# Altium schematic sheet MCU_4G_SEN.SchDoc
size A2; SheetNumber: 1; SheetTotal: 1
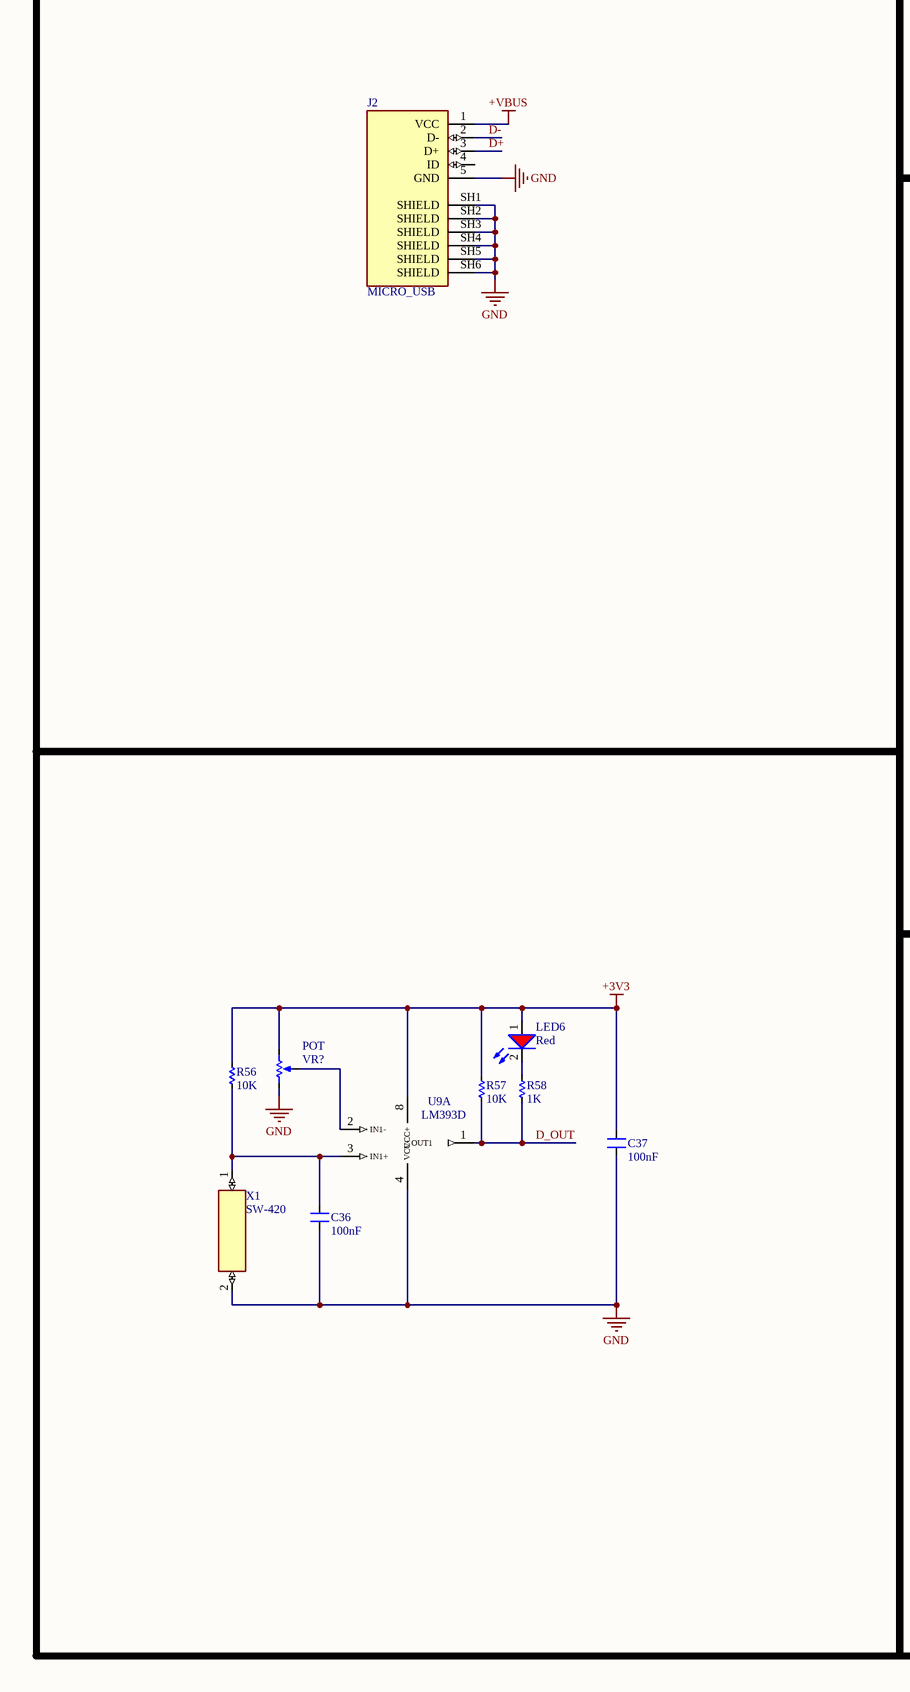
[diagram p0: MCU_4G_SEN.SchDoc, left]
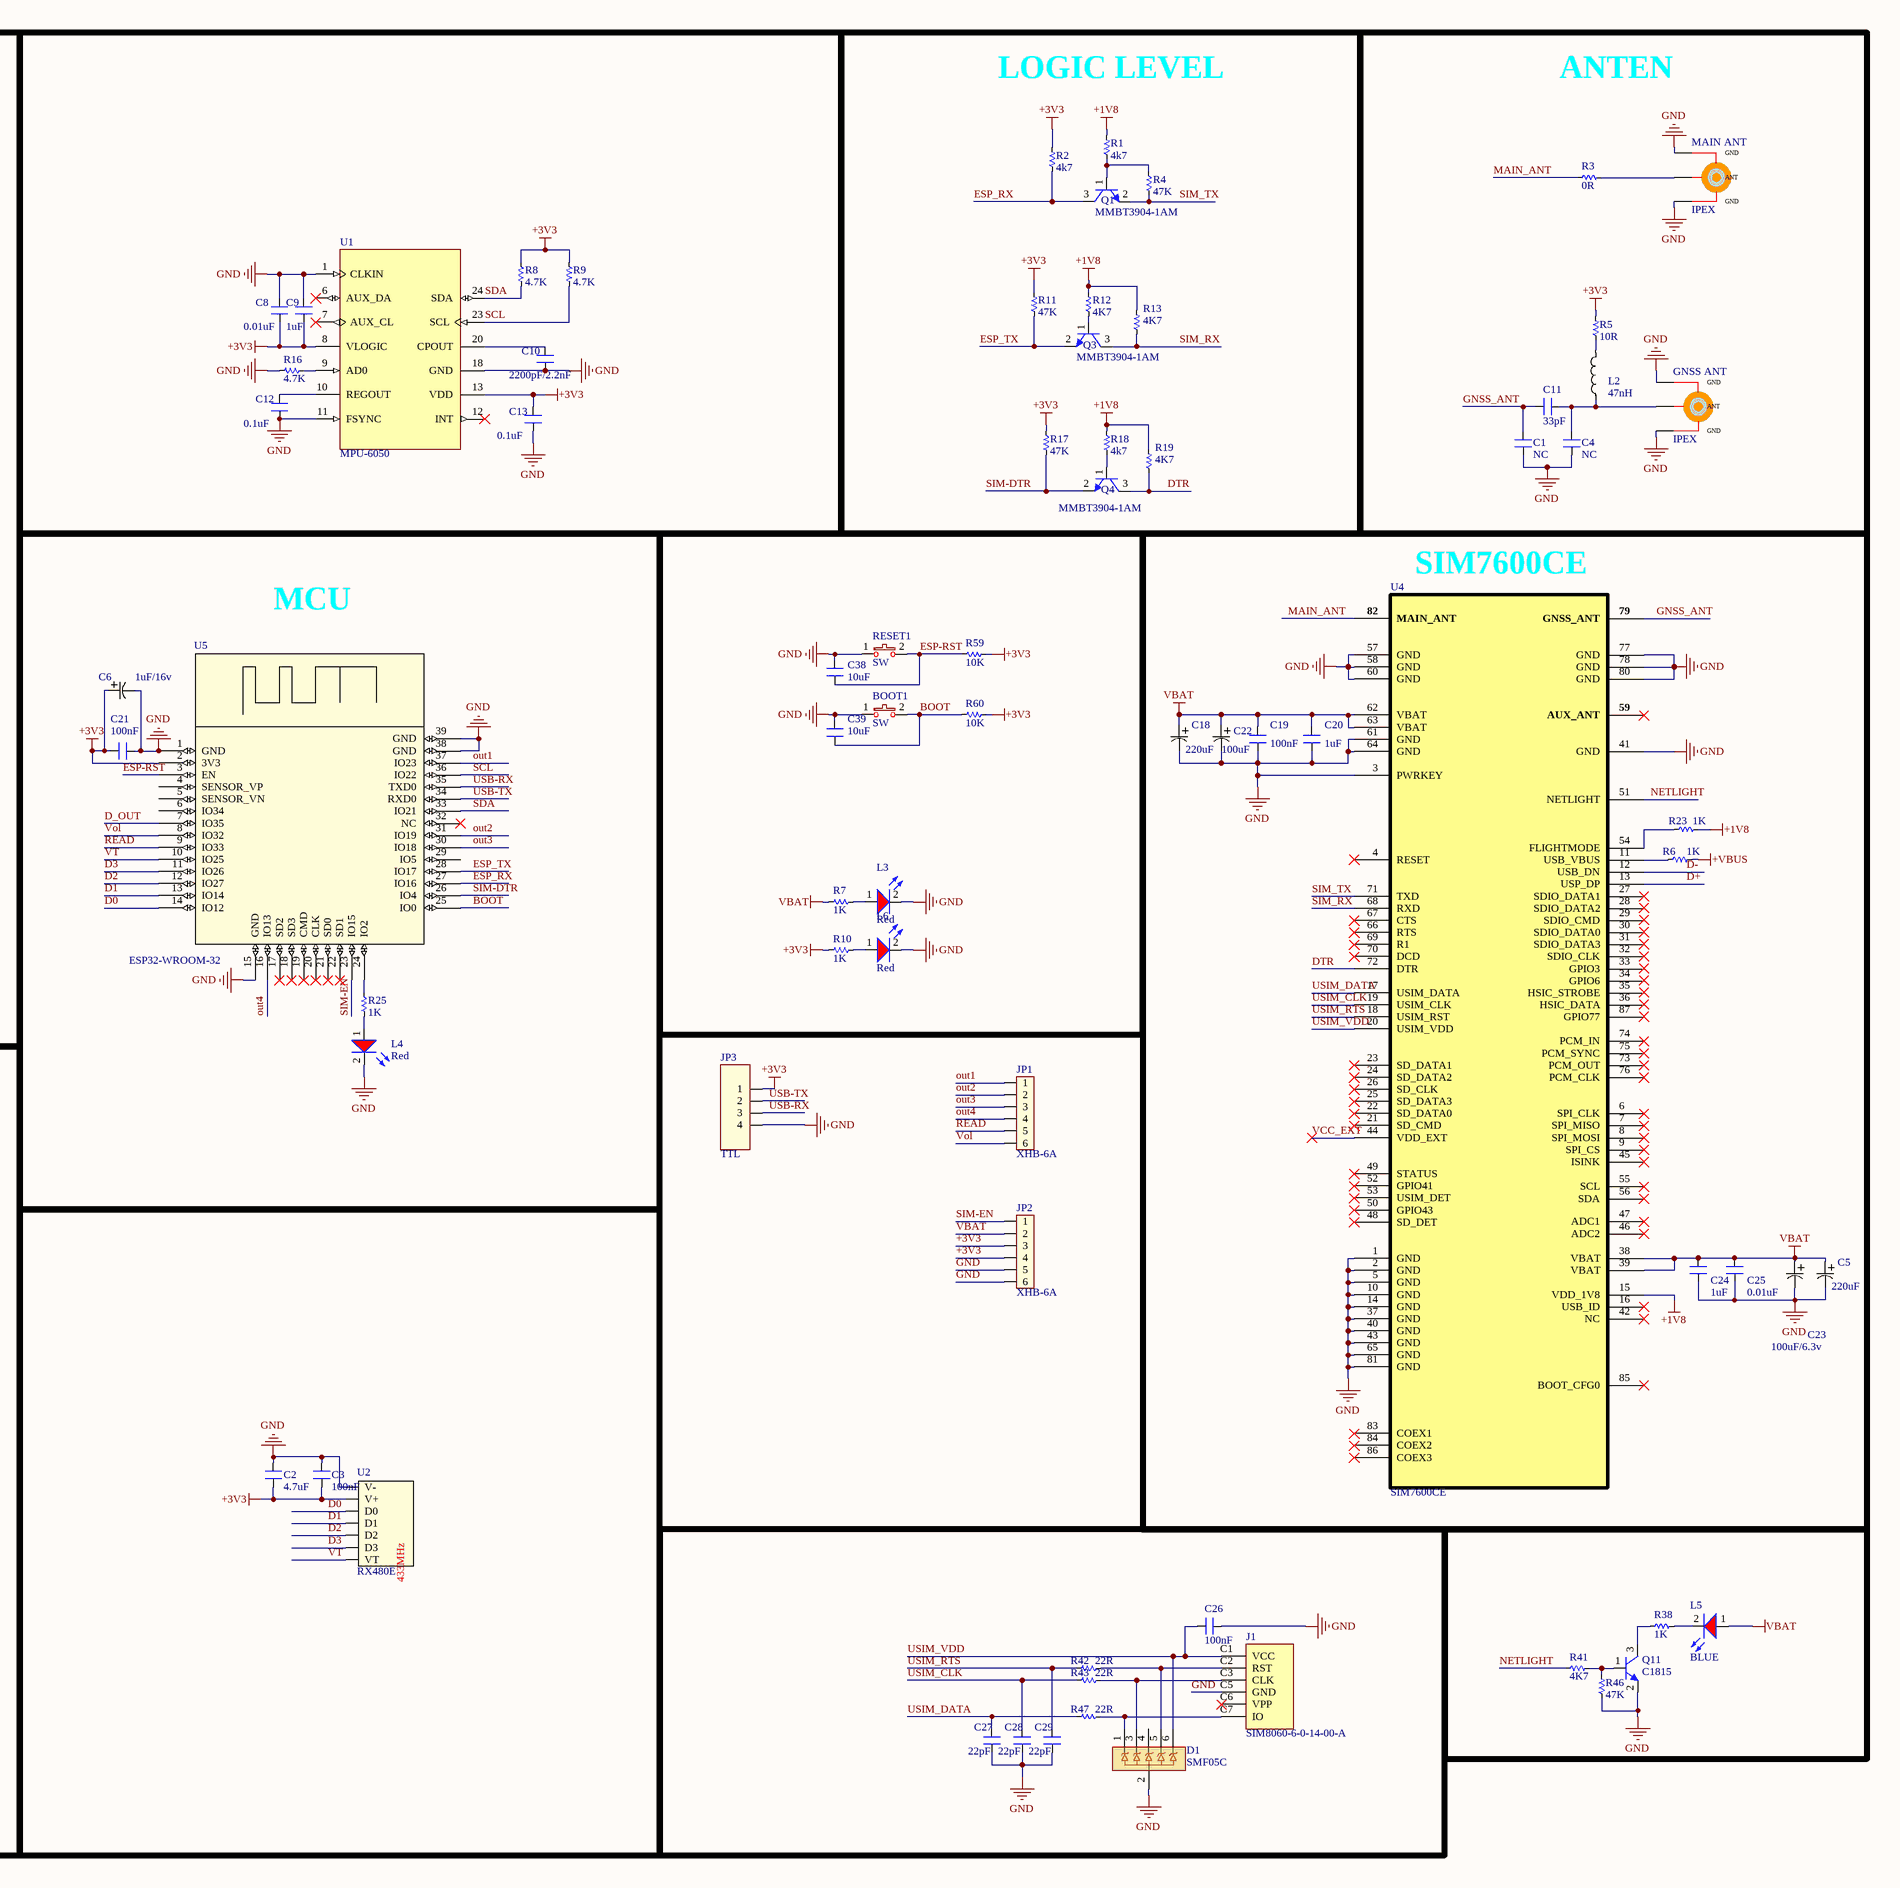
[diagram p1: MCU_4G_SEN.SchDoc, right]

## Parts
BOOT1  SW  [BUTTON_3X4MM_2PIN]
C1  NC  [CAP-0603]
C2  4.7uF  [CAP-0603]
C3  100nF  [CAP-0603]
C4  NC  [CAP-0603]
C5  220uF  [CAP-TANTALUM-2312 - ( 6032M )]
C6  1uF/16v  [CAP-TANTALUM-1206 - ( 3216 )]
C8  0.01uF  [CAP-0603]
C9  1uF  [CAP-0603]
C10  2200pF/2.2nF  [CAP-0603]
C11  33pF  [CAP-0603]
C12  0.1uF  [CAP-0603]
C13  0.1uF  [CAP-0603]
C18  220uF  [CAP-TANTALUM-2312 - ( 6032M )]
C19  100nF  [CAP-0603]
C20  1uF  [CAP-0603]
C21  100nF  [CAP-0603]
C22  100uF  [CAP-TANTALUM-1206 - ( 3216 )]
C23  100uF/6.3v  [CAP-TANTALUM-1206 - ( 3216 )]
C24  1uF  [CAP-0603]
C25  0.01uF  [CAP-0603]
C26  100nF  [CAP-0603]
C27  22pF  [CAP-0603]
C28  22pF  [CAP-0603]
C29  22pF  [CAP-0603]
C36  100nF  [CAP-0603]
C37  100nF  [CAP-0603]
C38  10uF  [CAP-0603]
C39  10uF  [CAP-0603]
D1  SMF05C  [SOT-363]
GNSS_ANT  IPEX  [IPEX-ANTEN]
J1  SIM8060-6-0-14-00-A  [NanoSim_BKK]
J2  MICRO_USB  [MICRO_USB _PAD]
JP1  XHB-6A  [XH2.54-6P_THRU]
JP2  XHB-6A  [XH2.54-6P_THRU]
JP3  TTL  [JP_4PIN]
L2  47nH  [IN-0603]
L3  value Red  [LED_0805_smd]  (hidden comment: LED)
L4  value Red  [LED_0805_smd]  (hidden comment: LED)
L5  value BLUE  [LED_0805_smd]  (hidden comment: LED)
L6  value Red  [LED_0805_smd]  (hidden comment: LED)
LED6  value Red  [LED_0805_smd]  (hidden comment: SMD)
MAIN_ANT  IPEX  [IPEX-ANTEN]
POT  VR?  [Pot_trim]
Q1  MMBT3904-1AM  [SOT-23]
Q3  MMBT3904-1AM  [SOT-23]
Q4  MMBT3904-1AM  [SOT-23]
Q11  C1815  [SOT-23]
R1  4k7  [RES-0603]
R2  4k7  [RES-0603]
R3  0R  [RES-0603]
R4  47K  [RES-0603]
R5  10R  [RES-0603]
R6  1K  [RES-0603]
R7  1K  [RES-0603]
R8  4.7K  [RES-0603]
R9  4.7K  [RES-0603]
R10  1K  [RES-0603]
R11  47K  [RES-0603]
R12  4K7  [RES-0603]
R13  4K7  [RES-0603]
R16  4.7K  [RES-0603]
R17  47K  [RES-0603]
R18  4k7  [RES-0603]
R19  4K7  [RES-0603]
R23  1K  [RES-0603]
R25  1K  [RES-0603]
R38  1K  [RES-0603]
R41  4K7  [RES-0603]
R42  22R  [RES-0603]
R43  22R  [RES-0603]
R46  47K  [RES-0603]
R47  22R  [RES-0603]
R56  10K  [RES-0603]
R57  10K  [RES-0603]
R58  1K  [RES-0603]
R59  10K  [RES-0603]
R60  10K  [RES-0603]
RESET1  SW  [BUTTON_3X4MM_2PIN]
U1  MPU-6050  [QFN-24]
U2  RX480E  [RX480E]
U4  SIM7600CE  [SIM7600C]
U5  ESP32-WROOM-32  [ESP32-WROOM-32D]
U9  LM393D  [SOIC-8]  (part A of 2)
X1  SW-420  [SW-420]

## Blocks framed on the sheet
LOGIC LEVEL: Q1 Q3 Q4 R1 R2 R4 R11-R13 R17-R19
ANTEN: C1 C4 C11 GNSS_ANT L2 MAIN_ANT R3 R5
MCU: C6 C21 L4 R25 U5
SIM7600CE: C5 C18-C20 C22-C25 R6 R23 U4

## Nets
+1V8: R1.1 R12.1 R13.1 R18.1 R19.1 R23.1 U4.15(VDD_1V8)
+3V3: C2.1 C3.1 C6.1 C8.1 C9.1 C13.2 C21.1 C37.2 JP2.3 JP2.4 JP3.1 LED6.1(A) POT.3(BOT) R2.1 R5.1 R8.2 R9.2 R10.1 R11.1 R17.1 R56.1 R57.1 R59.2 R60.2 U1.8(VLOGIC) U1.13(VDD) U2.2(V+) U5.2(3V3) U9.8(VCC+)
+VBUS: J2.1(VCC) R6.1
GND: BOOT1.1 C1.1 C2.2 C3.2 C4.1 C5.2 C6.2 C8.2 C9.2 C10.1 C12.1 C13.1 C18.2 C19.1 C20.1 C21.2 C22.2 C23.2 C24.1 C25.1 C26.2 C27.2 C28.2 C29.2 C36.1 C37.1 C38.1 C39.1 D1.2(C2) GNSS_ANT.1(GND) GNSS_ANT.3(GND) J1.C5(GND) J2.5(GND) J2.SH1(SHIELD) J2.SH2(SHIELD) J2.SH3(SHIELD) J2.SH4(SHIELD) J2.SH5(SHIELD) J2.SH6(SHIELD) JP2.5 JP2.6 JP3.4 L3.2(K) L4.2(K) L6.2(K) MAIN_ANT.1(GND) MAIN_ANT.3(GND) POT.1(TOP) Q11.2(E) R16.1 R46.2 RESET1.1 U1.1(CLKIN) U1.11(FSYNC) U1.18(GND) U2.1(V-) U4.1(GND) U4.2(GND) U4.3(PWRKEY) U4.5(GND) U4.10(GND) U4.14(GND) U4.37(GND) U4.40(GND) U4.41(GND) U4.43(GND) U4.57(GND) U4.58(GND) U4.60(GND) U4.61(GND) U4.64(GND) U4.65(GND) U4.77(GND) U4.78(GND) U4.80(GND) U4.81(GND) U5.1(GND) U5.15(GND) U5.38(GND) U5.39(GND) U9.4(VCC-) X1.2
VBAT: C5.1 C18.1 C19.2 C20.2 C22.1 C23.1 C24.2 C25.2 JP2.2 L5.1(A) R7.1 U4.38(VBAT) U4.39(VBAT) U4.62(VBAT) U4.63(VBAT)
BOOT: BOOT1.2 C39.2 R60.1 U5.25(IO0)
D0: U2.3(D0) U5.14(IO12)
D1: U2.4(D1) U5.13(IO14)
D2: U2.5(D2) U5.12(IO27)
D3: U2.6(D3) U5.11(IO26)
D+: J2.3(D+) U4.13(USP_DP)
D-: J2.2(D-) U4.12(USB_DN)
D_OUT: R57.2 R58.2 U5.7(IO35) U9.1(OUT1)
DTR: Q4.3(C) R19.2 U4.72(DTR)
ESP-RST: C38.2 R59.1 RESET1.2 U5.3(EN)
ESP_RX: Q1.3(C) R2.2 U5.27(IO16)
ESP_TX: Q3.2(E) R11.2 U5.28(IO17)
GNSS_ANT: C1.2 C11.1 U4.79(GNSS_ANT)
MAIN_ANT: R3.2 U4.82(MAIN_ANT)
NETLIGHT: R41.2 U4.51(NETLIGHT)
out1: JP1.1 U5.37(IO23)
out2: JP1.2 U5.31(IO19)
out3: JP1.3 U5.30(IO18)
out4: JP1.4 U5.16(IO13)
READ: JP1.5 U5.9(IO33)
SCL: R9.1 U1.23(SCL) U5.36(IO22)
SDA: R8.1 U1.24(SDA) U5.33(IO21)
SIM-DTR: Q4.2(E) R17.2 U5.26(IO4)
SIM-EN: JP2.1 U5.23(IO15)
SIM_RX: Q3.3(C) R13.2 U4.68(RXD)
SIM_TX: Q1.2(E) R4.2 U4.71(TXD)
USB-RX: JP3.3 U5.35(TXD0)
USB-TX: JP3.2 U5.34(RXD0)
USIM_CLK: C28.1 R43.1 U4.19(USIM_CLK)
USIM_DATA: C27.1 R47.1 U4.17(USIM_DATA)
USIM_RTS: C29.1 R42.1 U4.18(USIM_RST)
USIM_VDD: C26.1 D1.6(C6) J1.C1(VCC) U4.20(USIM_VDD)
VCC_EXT: U4.44(VDD_EXT)
Vol: JP1.6 U5.8(IO32)
VT: U2.7(VT) U5.10(IO25)
NetC4_2: C4.2 C11.2 GNSS_ANT.2(ANT) L2.1
NetC10_2: C10.2 U1.20(CPOUT)
NetC12_2: C12.2 U1.10(REGOUT)
NetC36_2: C36.2 R56.2 U9.3(IN1+) X1.1
NetD1_1: D1.1(C1) J1.C7(IO) R47.2
NetD1_3: D1.3(C3) J1.C3(CLK) R43.2
NetD1_5: D1.5(C5) J1.C2(RST) R42.2
NetL2_2: L2.2 R5.2
NetL3_1: L3.1(A) R7.2
NetL4_1: L4.1(A) R25.2
NetL5_2: L5.2(K) R38.1
NetL6_1: L6.1(A) R10.2
NetLED6_2: LED6.2(K) R58.1
NetMAIN_ANT_2: MAIN_ANT.2(ANT) R3.1
NetPOT_2: POT.2(TAP) U9.2(IN1-)
NetQ1_1: Q1.1(B) R1.2 R4.1
NetQ3_1: Q3.1(B) R12.2
NetQ4_1: Q4.1(B) R18.2
NetQ11_1: Q11.1(B) R41.1 R46.1
NetQ11_3: Q11.3(C) R38.2
NetR6_2: R6.2 U4.11(USB_VBUS)
NetR16_2: R16.2 U1.9(AD0)
NetR23_2: R23.2 U4.54(FLIGHTMODE)
NetR25_1: R25.1 U5.24(IO2)

Not connected (* = marked no-connect by the designer): D1 4(C4); J1 C6(VPP)*; J2 4(ID); U1 6(AUX_DA)* 7(AUX_CL)* 12(INT)*; U4 4(RESET) 6(SPI_CLK)* 7(SPI_MISO)* 8(SPI_MOSI)* 9(SPI_CS)* 16(USB_ID)* 21(SD_CMD)* 22(SD_DATA0)* 23(SD_DATA1)* 24(SD_DATA2)* 25(SD_DATA3)* 26(SD_CLK)* 27(SDIO_DATA1)* 28(SDIO_DATA2) 29(SDIO_CMD) 30(SDIO_DATA0) 31(SDIO_DATA3) 32(SDIO_CLK) 33(GPIO3) 34(GPIO6) 35(HSIC_STROBE) 36(HSIC_DATA) 42(NC)* 45(ISINK)* 46(ADC2)* 47(ADC1)* 48(SD_DET)* 49(STATUS)* 50(GPIO43)* 52(GPIO41)* 53(USIM_DET)* 55(SCL)* 56(SDA)* 59(AUX_ANT)* 66(RTS)* 67(CTS)* 69(R1)* 70(DCD)* 73(PCM_OUT)* 74(PCM_IN)* 75(PCM_SYNC)* 76(PCM_CLK)* 83(COEX1)* 84(COEX2)* 85(BOOT_CFG0)* 86(COEX3)* 87(GPIO77); U5 4(SENSOR_VP) 5(SENSOR_VN) 6(IO34) 17(SD2)* 18(SD3)* 19(CMD)* 20(CLK)* 21(SD0)* 22(SD1)* 29(IO5) 32(NC)*

## Notes on the sheet
- (in symbol RX480E) 433MHz

## Library data of the parts
BOOT1 RESET1 = BUTON2
C1-C4 C8-C13 C19-C21 C24-C29 C36-C39 = CAP ko phan cuc: Cap np W0.3; Value: 0,047uF; Copyright: VanDungEvn
C5 C6 C18 C22 C23 = CAP_PHANCUCDEN
GNSS_ANT MAIN_ANT = IPEX-ANTEN
J1 = NanoSim_SIM8060-6-0-14-00-A: 6 Position Card Connector NANO SIM Surface Mount, Right Angle Gold; MF: Global Connector Technology; MP: SIM8060-6-0-14-00-A; Package: Package Analog Devices; Price: None; Availability: Unavailable; SnapEDA_Link: https://www.snapeda.com/parts/SIM8060-6-0-14-00-A/Global%20Connector%20Technology/view-part/3214904/?ref=snap; Value: *
J2 = MICRO_USB: Micro USB, Input Output Connectors, B TYPE RECEPTACLE with flange; MF: Amphenol ICC; MP: 10118194-0001LF; SnapEDA_Link: https://www.snapeda.com/parts/10118194-0001LF/Amphenol+FCI/view-part/?ref=snap; Package: None; Value: *; Check_prices: https://www.snapeda.com/parts/10118194-0001LF/Amphenol+FCI/view-part/?ref=eda
JP1 JP2 = JP6: JP6 PIN; Value: JP7
JP3 = JP4
L2 = IN
L3-L6 LED6 = LED_RED_SMD: LED Red 3mm/5MM; ComponentLink1Description: Datasheet; ComponentLink1URL: D:\Dropbox\Datasheets\Opto and Illumination\LEDs\SMD LED.pdf; Unit Price: 0.0476
POT = Pot mini
Q1 Q3 Q4 Q11 = C1815-SMD: Trans NPN 50V 150mA TO-92; ComponentLink1Description: Datasheet; ComponentLink1URL: D:\Dropbox\Datasheets\Transistors\P Channel Bipolar\2SC1815.pdf; Unit Price: 0.0143
R1-R13 R16-R19 R23 R25 R38 R41-R43 R46 R47 R56-R60 = Res: Manufacturer: Generic Components; Class: Passive; SubClass: R; Published: 08/06/2000; Publisher: Altium Hobart Technology Centre
U4 = SIM7600CE*
X1 = SW-420: ç”µåŠ›å˜åŽ‹å™¨ 2500Vrms 6VA 6 ç«¯å­ PC å¼•è„šé€šå­”; MF: Stancor; Package: None; Price: None; Value: *; SnapEDA_Link: https://www.snapeda.com/parts/SW-420/Stancor/view-part/?ref=snap; MP: SW-420; Availability: In Stock; Check_prices: https://www.snapeda.com/parts/SW-420/Stancor/view-part/?ref=eda